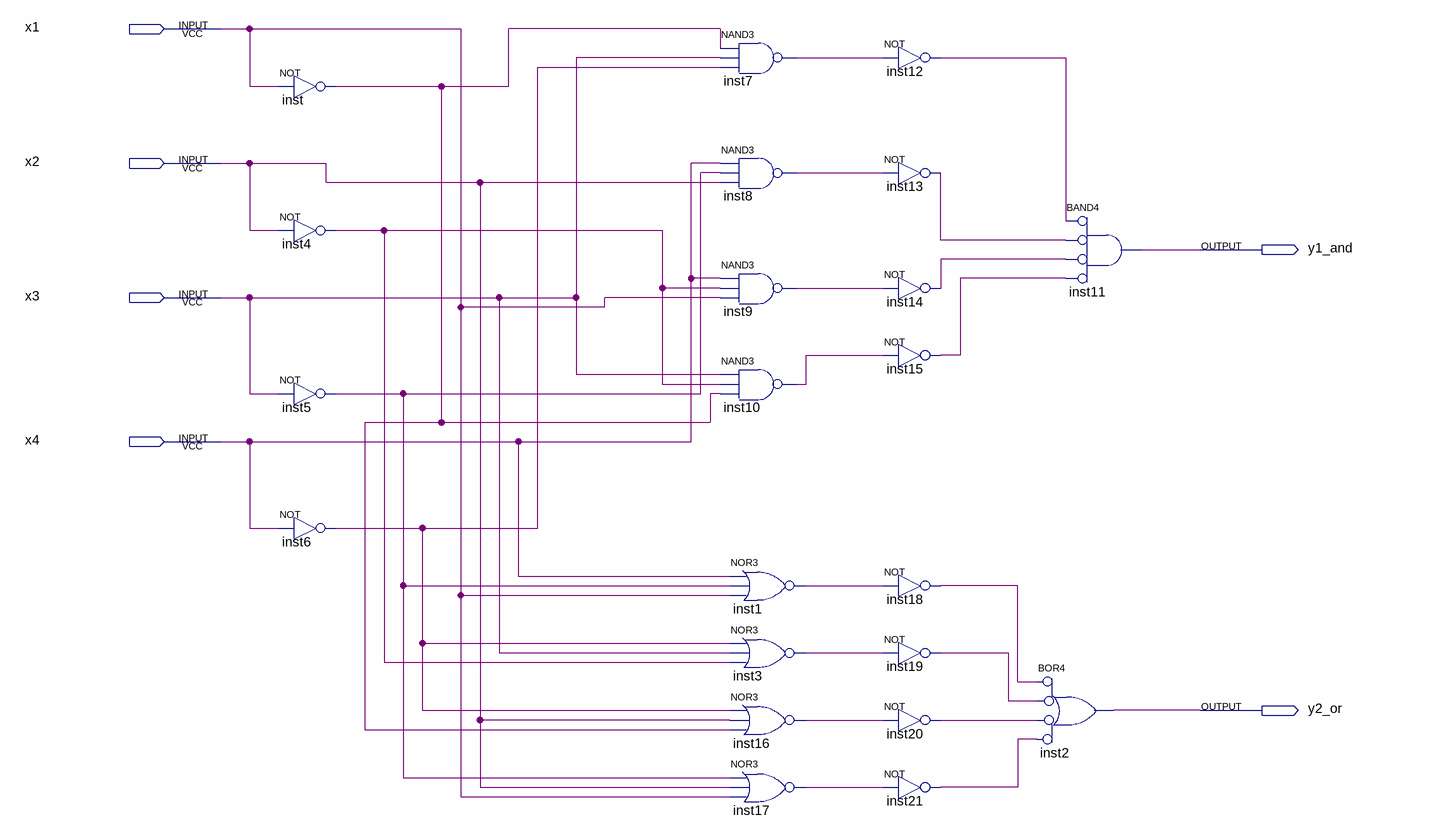
[diagram p0: schematic sheet]
// Quartus schematic Laboratory_1.bdf as structural Verilog: 22 symbols, 6 pins
module Laboratory_1 (
  input  x1,
  input  x2,
  input  x3,
  input  x4,
  output y1_and,
  output y2_or
);

  wire inst1_out, inst3_out, inst4_out, inst5_out, inst6_out, inst7_out, inst8_out, inst9_out, inst10_out,
       inst12_out, inst13_out, inst14_out, inst15_out, inst16_out, inst17_out, inst18_out, inst19_out,
       inst20_out, inst21_out, inst_out;

  not inst (inst_out, x1);
  not inst4 (inst4_out, x2);
  not inst5 (inst5_out, x3);
  not inst6 (inst6_out, x4);
  nand inst7 (inst7_out, inst_out, x3, inst6_out);
  nand inst8 (inst8_out, x4, inst5_out, x2);
  nand inst9 (inst9_out, x4, inst4_out, x1);
  nand inst10 (inst10_out, x3, inst4_out, inst_out);
  nor inst1 (inst1_out, x4, inst5_out, x1);
  nor inst3 (inst3_out, inst6_out, x3, inst4_out);
  nor inst16 (inst16_out, inst6_out, x2, inst_out);
  nor inst17 (inst17_out, inst5_out, x2, x1);
  not inst12 (inst12_out, inst7_out);
  not inst13 (inst13_out, inst8_out);
  not inst14 (inst14_out, inst9_out);
  not inst15 (inst15_out, inst10_out);
  not inst18 (inst18_out, inst1_out);
  not inst19 (inst19_out, inst3_out);
  not inst20 (inst20_out, inst16_out);
  not inst21 (inst21_out, inst17_out);
  and inst11 (y1_and, ~inst12_out, ~inst13_out, ~inst14_out, ~inst15_out);  // BAND4
  or inst2 (y2_or, ~inst18_out, ~inst19_out, ~inst20_out, ~inst21_out);  // BOR4
endmodule
